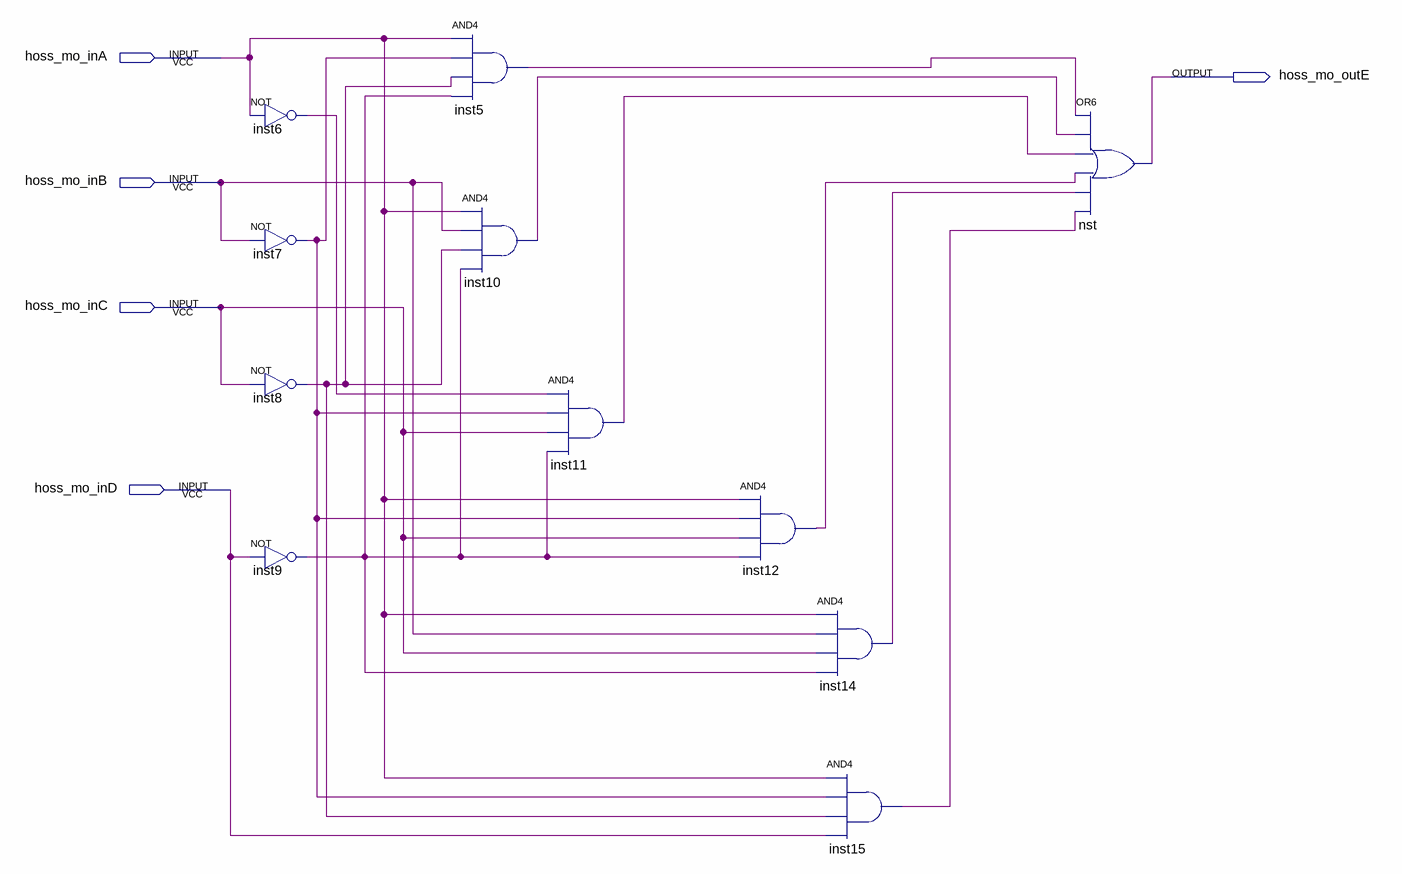
[diagram p0: schematic sheet]
// Quartus schematic segmentE.bdf as structural Verilog: 11 symbols, 5 pins
module segmentE (
  input  hoss_mo_inA,
  input  hoss_mo_inB,
  input  hoss_mo_inC,
  input  hoss_mo_inD,
  output hoss_mo_outE
);

  wire inst5_out, inst6_out, inst7_out, inst8_out, inst9_out, inst10_out, inst11_out, inst12_out, inst14_out,
       inst15_out;

  not inst6 (inst6_out, hoss_mo_inA);
  not inst7 (inst7_out, hoss_mo_inB);
  not inst8 (inst8_out, hoss_mo_inC);
  not inst9 (inst9_out, hoss_mo_inD);
  and inst5 (inst5_out, hoss_mo_inA, inst7_out, inst8_out, inst9_out);
  and inst10 (inst10_out, hoss_mo_inA, hoss_mo_inB, inst8_out, inst9_out);
  and inst11 (inst11_out, inst6_out, inst7_out, hoss_mo_inC, inst9_out);
  and inst12 (inst12_out, hoss_mo_inA, inst7_out, hoss_mo_inC, inst9_out);
  and inst14 (inst14_out, hoss_mo_inA, hoss_mo_inB, hoss_mo_inC, inst9_out);
  and inst15 (inst15_out, hoss_mo_inA, inst7_out, inst8_out, hoss_mo_inD);
  or nst (hoss_mo_outE, inst5_out, inst10_out, inst11_out, inst12_out, inst14_out, inst15_out);
endmodule
